# Altium project BB_H11L1_TXRX.PrjPcb
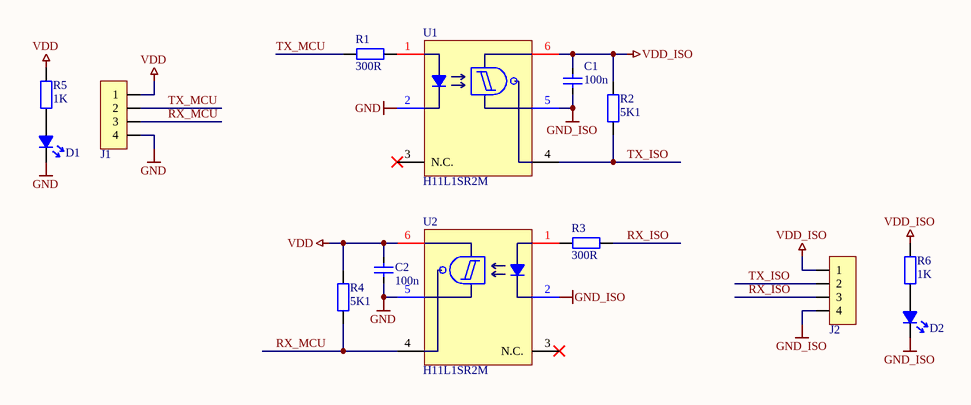
[diagram p0: Breakout.SchDoc]
Title: H11L1 TX/RX Optocoupler Board; Revision: A; DrawnBy: A.G.; Date: 2022/08/13
1 sheet, 14 parts. Net scope: global (net labels, ports and power ports of the same name join across sheets).
Board file: BB_H11L1_TXRX.PcbDoc

## Sheet Breakout.SchDoc: H11L1 TX/RX Optocoupler Board
size A4; Date: 2022/08/13; DrawnBy: A.G.; DocumentNumber: 1; Revision: A; SheetNumber: 1; ProjectName: BB_H11L1_TXRX.PrjPcb

### Parts
C1  100n  [0805C_RF_M]
C2  100n  [0805C_RF_M]
D1  Unspecified  [0805LED_RF_M]  (value not drawn)
D2  Unspecified  [0805LED_RF_M]  (value not drawn)
J1  PINHDR-4P1  [HEADER-2.54-4P1]  (value not drawn)
J2  PINHDR-4P1  [HEADER-2.54-4P1]  (value not drawn)
R1  300R  [0805R_RF_M]
R2  5K1  [0805R_RF_M]
R3  300R  [0805R_RF_M]
R4  5K1  [0805R_RF_M]
R5  1K  [0805R_RF_M]
R6  1K  [0805R_RF_M]
U1  H11L1SR2M  [H11L1SR2M_SMD-6]
U2  H11L1SR2M  [H11L1SR2M_SMD-6]

### Nets
GND: C2.1 D1.C J1.4 U1.2(C) U2.5(GND)
GND_ISO: C1.1 D2.C J2.4 U1.5(GND) U2.2(C)
VDD: C2.2 J1.1 R4.2 R5.2 U2.6(VCC)
VDD_ISO: C1.2 J2.1 R2.2 R6.2 U1.6(VCC)
RX_ISO: J2.3 R3.2
RX_MCU: J1.3 R4.1 U2.4(OUT)
TX_ISO: J2.2 R2.1 U1.4(OUT)
TX_MCU: J1.2 R1.1
NetD1_A: D1.A R5.1
NetD2_A: D2.A R6.1
NetR1_2: R1.2 U1.1(A)
NetR3_1: R3.1 U2.1(A)

Not connected (* = marked no-connect by the designer): U1 3(N.C.)*; U2 3(N.C.)*

### Notes on the sheet
- Author
- Date
- Revision
- Size
- A4
- Sheet
- of

### Library data of the parts
C1 C2 = C: Capacitor; Manufacturer: Generic Brand; Max Voltage: ? V; Value: 100n; Tolerance: ?; Mounting Technology: SMT; Tag: *; Manufacturer Part No: *; Supplier: *; Supplier Link: http://; Supplier Part No: *; Category: Capacitor
D1 D2 = LED: Manufacturer: Generic Brand; Forward Voltage Drop: ? V; Emitting Color: Unspecified; Manufacturer Part No: *; Supplier: *; Supplier Link: http://; Supplier Part No: *; Category: Diode; Mounting Technology: SMT
J1 J2 = PINHDR-4P1: Generic Pin Header 4x1
R1-R6 = R: Resistor; Manufacturer: Generic Brand; Power Rating: ? W; Max Voltage: ? V; Tolerance: ?; Supplier Link: http://; Category: Resistor; Mounting Technology: SMT
  R1 R3: Value: 300R
  R2 R4: Value: 5K1
  R5 R6: Value: 1K
U1 U2 = H11L1SR2M: OPTOISO 4.17KV OPN COLL SMD-6; Manufacturer: ON Semiconductor; Supplier URL: https://www.digikey.com/en/products/detail/on-semiconductor/H11L1SR2M/458856; Supplier Part No: H11L1SR2MCT-ND; Manufacturer Part No: H11L1SR2M; Mounting Type: SMT; Package: SMD-6; Supplier: DigiKey; Alternative Supplier: Chipdip; Alternative Supplier Link: https://www.chipdip.by/product/h11l1sr2m; Alternative Supplier Part No: 753715628